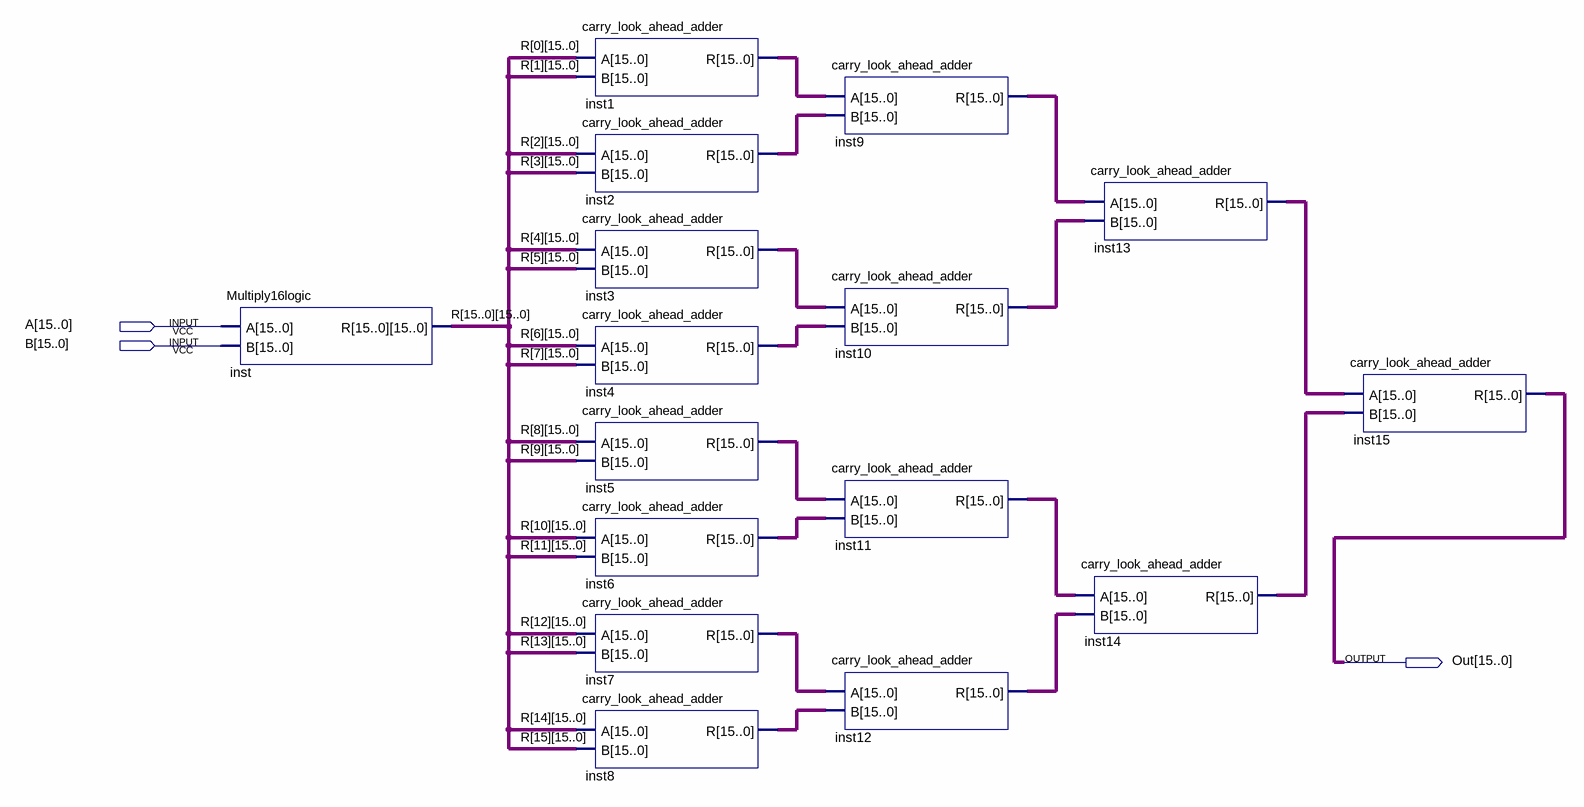
[diagram p0: schematic sheet]
// Quartus schematic Quick_Multiply16.bdf as structural Verilog: 16 symbols, 3 pins
module Quick_Multiply16 (
  input  [15:0] A,
  input  [15:0] B,
  output [15:0] Out
);

  wire [15:0] inst1_r, inst2_r, inst3_r, inst4_r, inst5_r, inst6_r, inst7_r, inst8_r, inst9_r, inst10_r,
       inst11_r, inst12_r, inst13_r, inst14_r, R_0, R_1, R_2, R_3, R_4, R_5, R_6, R_7, R_8, R_9, R_10, R_11,
       R_12, R_13, R_14, R_15;

  Multiply16logic inst (
    .A(A), .B(B), .R({R_15, R_14, R_13, R_12, R_11, R_10, R_9, R_8, R_7, R_6, R_5, R_4, R_3, R_2, R_1, R_0}));
  carry_look_ahead_adder inst1 (.A(R_0), .B(R_1), .R(inst1_r));
  carry_look_ahead_adder inst2 (.A(R_2), .B(R_3), .R(inst2_r));
  carry_look_ahead_adder inst3 (.A(R_4), .B(R_5), .R(inst3_r));
  carry_look_ahead_adder inst4 (.A(R_6), .B(R_7), .R(inst4_r));
  carry_look_ahead_adder inst5 (.A(R_8), .B(R_9), .R(inst5_r));
  carry_look_ahead_adder inst6 (.A(R_10), .B(R_11), .R(inst6_r));
  carry_look_ahead_adder inst7 (.A(R_12), .B(R_13), .R(inst7_r));
  carry_look_ahead_adder inst8 (.A(R_14), .B(R_15), .R(inst8_r));
  carry_look_ahead_adder inst9 (.A(inst1_r), .B(inst2_r), .R(inst9_r));
  carry_look_ahead_adder inst10 (.A(inst3_r), .B(inst4_r), .R(inst10_r));
  carry_look_ahead_adder inst11 (.A(inst5_r), .B(inst6_r), .R(inst11_r));
  carry_look_ahead_adder inst12 (.A(inst7_r), .B(inst8_r), .R(inst12_r));
  carry_look_ahead_adder inst13 (.A(inst9_r), .B(inst10_r), .R(inst13_r));
  carry_look_ahead_adder inst14 (.A(inst11_r), .B(inst12_r), .R(inst14_r));
  carry_look_ahead_adder inst15 (.A(inst13_r), .B(inst14_r), .R(Out));
endmodule
